# EAGLE design Passthrough Meter (EAGLE 6.2)
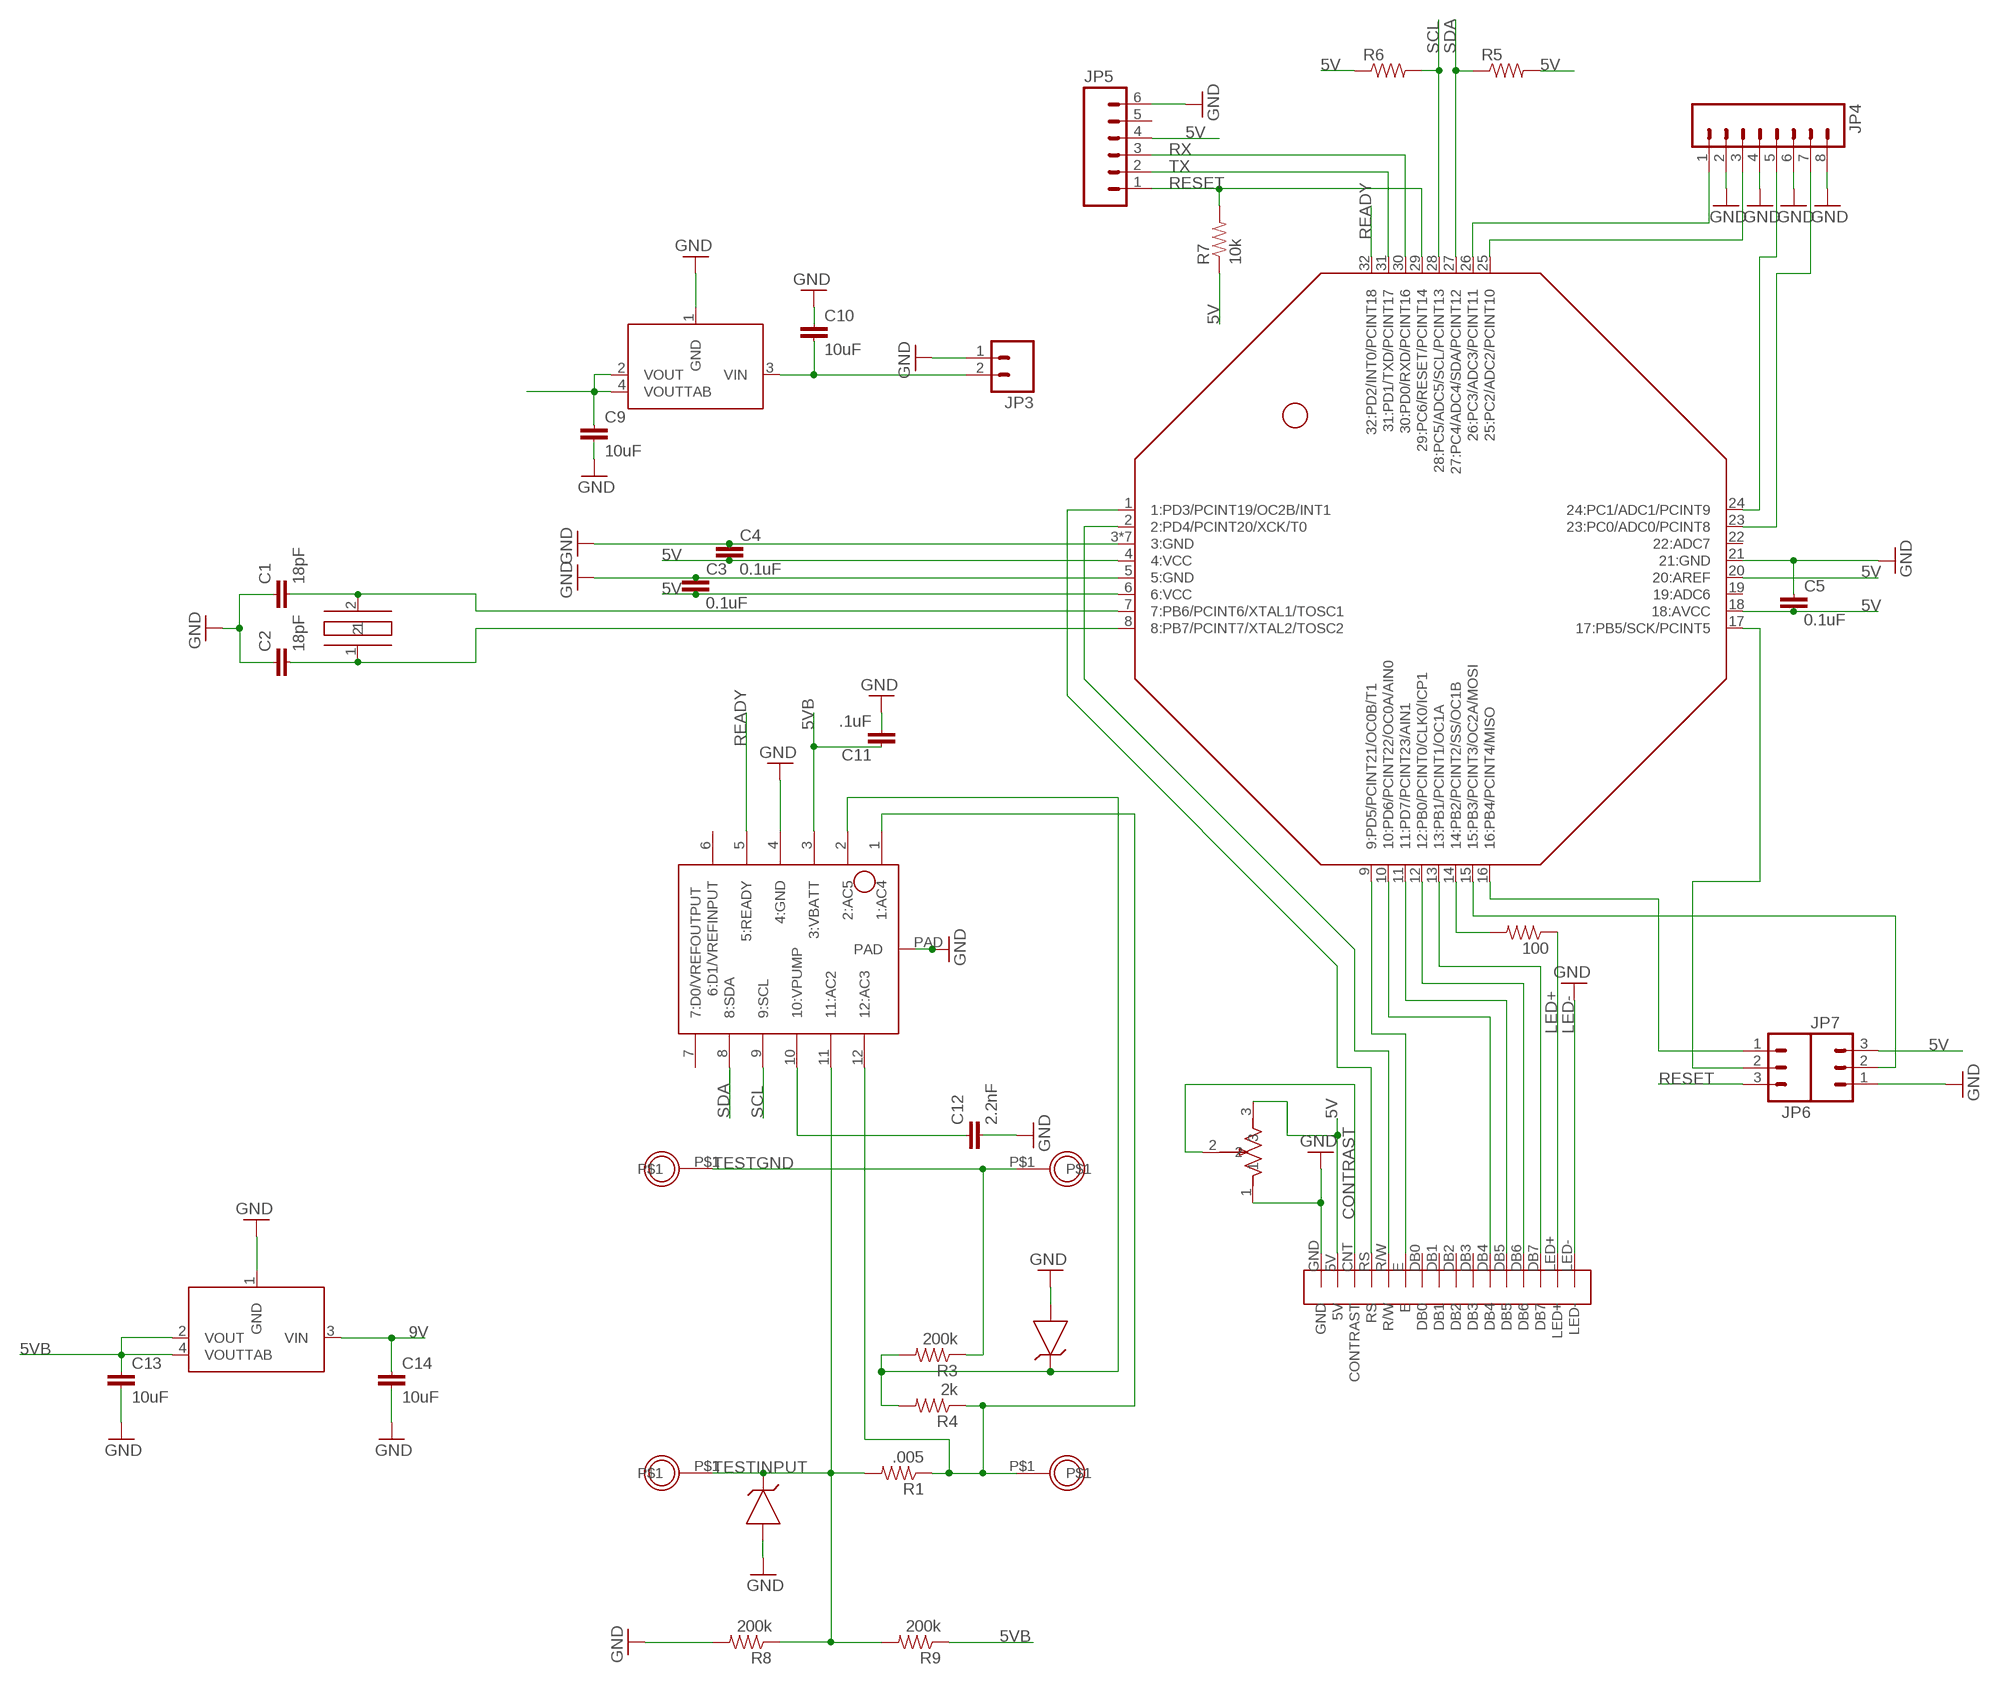
[diagram p0: schematic, sheet 1]

## Parts
100  RESISTOR  [0805]
C1  18pF  CAP0603-CAP  [0603-CAP]
C2  18pF  CAP0603-CAP  [0603-CAP]
C3  0.1uF  CAP0805  [0805]
C4  0.1uF  CAP0805  [0805]
C5  0.1uF  CAP0805  [0805]
C9  10uF  CAP1206  [1206]
C10  10uF  CAP1206  [1206]
C11  .1uF  CAP0805  [0805]
C12  2.2nF  CAP0805  [0805]
C13  10uF  CAP1206  [1206]
C14  10uF  CAP1206  [1206]
JP3  M02LOCK  [1X02_LOCK]
JP4  M08LOCK  [1X08_LOCK]
JP5  M06LOCK  [1X06_LOCK]
JP6  M03LOCK  [1X03_LOCK]
JP7  M03LOCK  [1X03_LOCK]
R1  .005  RESISTOR-OAR-5  [OAR5]
R3  200k  RESISTOR-PRECISION-R1  [PRECISION-R1]
R4  2k  RESISTOR  [0805]
R5  RESISTOR  [0805]
R6  RESISTOR  [0805]
R7  10k  RESISTOR  [0805]
R8  200k  RESISTOR-PRECISION-R1  [PRECISION-R1]
R9  200k  RESISTOR-PRECISION-R1  [PRECISION-R1]
U$1  HC49US  [HC49US]
U$3  ATMEGA328SMD-QFN  [QFN-32]
U$4  SX8723  [MPLD-W-12-4X4]
U$5  ZENER_DIODE-SOD-323  [SOD-323]
U$6  TRIMPOTTC33X-2  [TC33X-2]
U$7  THROUGH_HOLE-3MM  THROUGH_HOLE_2.2MM  [THROUGH_HOLE_2.2MM]
U$8  THROUGH_HOLE-3MM  THROUGH_HOLE_2.2MM  [THROUGH_HOLE_2.2MM]
U$9  THROUGH_HOLE-3MM  THROUGH_HOLE_2.2MM  [THROUGH_HOLE_2.2MM]
U$10  THROUGH_HOLE-3MM  THROUGH_HOLE_2.2MM  [THROUGH_HOLE_2.2MM]
U$13  5V-LDO-ZLDO1117  [ZLDO1117]
U$14  5V-LDO-ZLDO1117  [ZLDO1117]
U$15  ZENER_DIODE-SOD-323  [SOD-323]
U$16  LCD  [LCD]

## Nets
5V: C3.2 C4.2 C5.2 C9.1 JP5.4 JP7.3 R5.2 R6.1 R7.1 U$3.4(4:VCC) U$3.6(6:VCC) U$3.18(18:AVCC) U$3.20(20:AREF) U$6.3 U$13.2(VOUT) U$13.4(VOUTTAB) U$16.5V
5VB: C11.1 C13.1 R9.1 U$4.3(3:VBATT) U$14.2(VOUT) U$14.4(VOUTTAB)
9V: C10.2 C14.1 JP3.2 U$13.3(VIN) U$14.3(VIN)
A0: JP4.7 U$3.23(23:PC0/ADC0/PCINT8)
A1: JP4.5 U$3.24(24:PC1/ADC1/PCINT9)
A2: JP4.3 U$3.25(25:PC2/ADC2/PCINT10)
A3: JP4.1 U$3.26(26:PC3/ADC3/PCINT11)
CONTRAST: U$6.2 U$16.CNT(CONTRAST)
DB7: JP7.2 U$3.15(15:PB3/PCINT3/OC2A/MOSI)
GND: C1.1 C2.1 C3.1 C4.1 C5.1 C9.2 C10.1 C11.2 C12.2 C13.2 C14.2 JP3.1 JP4.2 JP4.4 JP4.6 JP4.8 JP5.6 JP7.1 R8.2 U$3.3(3:GND) U$3.5(5:GND) U$3.21(21:GND) U$3.P1(3:GND) U$3.P2(3:GND) U$3.P3(3:GND) U$3.P4(3:GND) U$3.P5(3:GND) U$3.PAD(3:GND) U$4.4(4:GND) U$4.PAD U$5.2(A) U$6.1 U$13.1(GND) U$14.1(GND) U$15.2(A) U$16.GND
LED+: 100.1 U$16.LED+
LED-: U$16.LED- ; supply symbol labelled GND
MISO: JP6.1 U$3.16(16:PB4/PCINT4/MISO)
N$1: C2.2 U$1.1 U$3.8(8:PB7/PCINT7/XTAL2/TOSC2)
N$2: C1.2 U$1.2 U$3.7(7:PB6/PCINT6/XTAL1/TOSC1)
N$3: 100.2 U$3.14(14:PB2/PCINT2/SS/OC1B)
N$5: U$3.13(13:PB1/PCINT1/OC1A) U$16.DB7
N$6: U$3.12(12:PB0/PCINT0/CLK0/ICP1) U$16.DB6
N$7: U$3.11(11:PD7/PCINT23/AIN1) U$16.DB5
N$8: U$3.10(10:PD6/PCINT22/OC0A/AIN0) U$16.DB4
N$9: U$3.9(9:PD5/PCINT21/OC0B/T1) U$16.E
N$10: U$3.2(2:PD4/PCINT20/XCK/T0) U$16.R/W
N$11: U$3.1(1:PD3/PCINT19/OC2B/INT1) U$16.RS
N$21: C12.1 U$4.10(10:VPUMP)
N$30: R3.2 R4.2 U$4.2(2:AC5) U$5.1(C)
READY: U$3.32(32:PD2/INT0/PCINT18) U$4.5(5:READY)
RESET: JP5.1 JP6.3 R7.2 U$3.29(29:PC6/RESET/PCINT14)
RX: JP5.3 U$3.30(30:PD0/RXD/PCINT16)
SCK: JP6.2 U$3.17(17:PB5/SCK/PCINT5)
SCL: R6.2 U$3.28(28:PC5/ADC5/SCL/PCINT13) U$4.9(9:SCL)
SDA: R5.1 U$3.27(27:PC4/ADC4/SDA/PCINT12) U$4.8(8:SDA)
TESTGND: R3.1 U$7.P$1 U$8.P$1
TESTINPUT: R1.2 R8.1 R9.2 U$4.11(11:AC2) U$9.P$1 U$15.1(C)
TESTOUTPUT: R1.1 R4.1 U$4.1(1:AC4) U$4.12(12:AC3) U$10.P$1
TX: JP5.2 U$3.31(31:PD1/TXD/PCINT17)
Unconnected: JP5.5 U$3.19(19:ADC6) U$3.22(22:ADC7) U$4.6(6:D1/VREFINPUT) U$4.7(7:D0/VREFOUTPUT) U$16.DB0 U$16.DB1 U$16.DB2 U$16.DB3

## Library data of the parts
100 R1 R3-R9 = 1dah:RESISTOR: Resistor Basic schematic elements and footprints for 0603, 1206, and PTH 1/10th watt (small) resistors.
C1-C5 C9-C14 = 1dah:CAP: Capacitor Standard 0402 ceramic capacitor, and 0.1" leaded capacitor.
JP3 = 1dah:M02: Header 2 Standard 2-pin 0.1" header. Use with straight break away headers (SKU : PRT-00116), right angle break away headers (PRT-00553), swiss pins (PRT-00743), machine pins (PRT-00117), and female headers (PRT-00115). Molex polarized connector foot print use with SKU : PRT-08233 with associated crimp pins and housings.
JP4 = 1dah:M08: Header 8 Standard 8-pin 0.1" header. Use with straight break away headers (SKU : PRT-00116), right angle break away headers (PRT-00553), swiss pins (PRT-00743), machine pins (PRT-00117), and female headers (PRT-00115).
JP5 = 1dah:M06: Header 6 Standard 6-pin 0.1" header. Use with straight break away headers (SKU : PRT-00116), right angle break away headers (PRT-00553), swiss pins (PRT-00743), machine pins (PRT-00117), and female headers (PRT-00115). Molex polarized connector foot print use with SKU : PRT-08094 with associated crimp pins and housings. NOTES ON THE VARIANTS LOCK and LOCK_LONGPADS... This footprint was designed to help hold the alignment of a through-hole component (i.e. 6-pin header) while soldering it into place. You may notice that each hole has been shifted either up or down by 0.005 of an inch from it's more standard position (which is a perfectly straight line). This slight alteration caused the pins (the squares in the middle) to touch the edges of the holes. Because they are alternating, it causes a "brace" to hold the component in place. 0.005 has proven to be the perfect amount of "off-center" position when using our standard breakaway headers. Although looks a little odd when you look at the bare footprint, once you have a header in there, the alteration is very hard to notice. Also, if you push a header all the way into place, it is covered up entirely on the bottom side. This idea of altering the position of holes to aid alignment will be further integrated into the Sparkfun Library for other footprints. It can help hold any component with 3 or more connection pins.
JP6 JP7 = 1dah:M03: Header 3 Standard 3-pin 0.1" header. Use with straight break away headers (SKU : PRT-00116), right angle break away headers (PRT-00553), swiss pins (PRT-00743), machine pins (PRT-00117), and female headers (PRT-00115). Molex polarized connector foot print use with SKU : PRT-08232 with associated crimp pins and housings.
U$1 = 1dah:HC49US: 16 MHz crystal
U$3 = 1dah:ATMEGA328SMD
U$4 = 1dah:SX8723
U$5 U$15 = 1dah:ZENER_DIODE
U$6 = 1dah:TRIMPOT: Bournes Trimpot
U$7-U$10 = 1dah:THROUGH_HOLE
U$13 U$14 = 1dah:5V-LDO: 5 V LDO, 12V input, 1 A
U$16 = 1dah:LCD

## Board
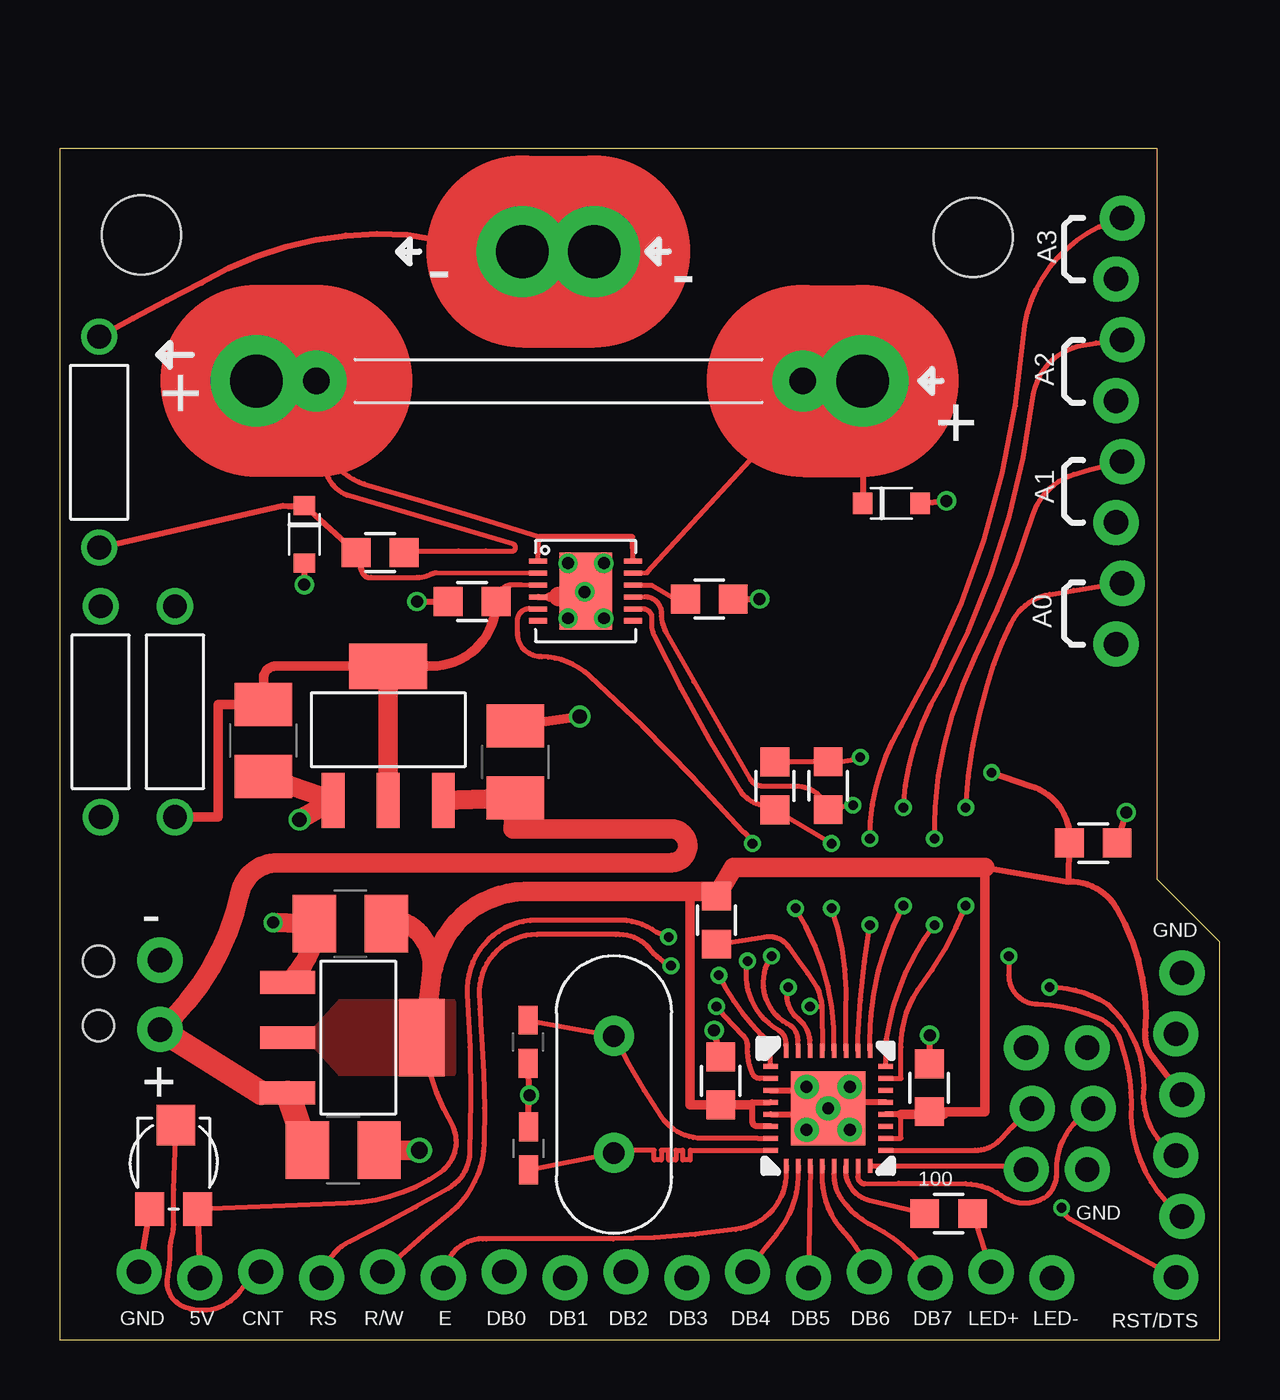
[diagram p1: board, top side]
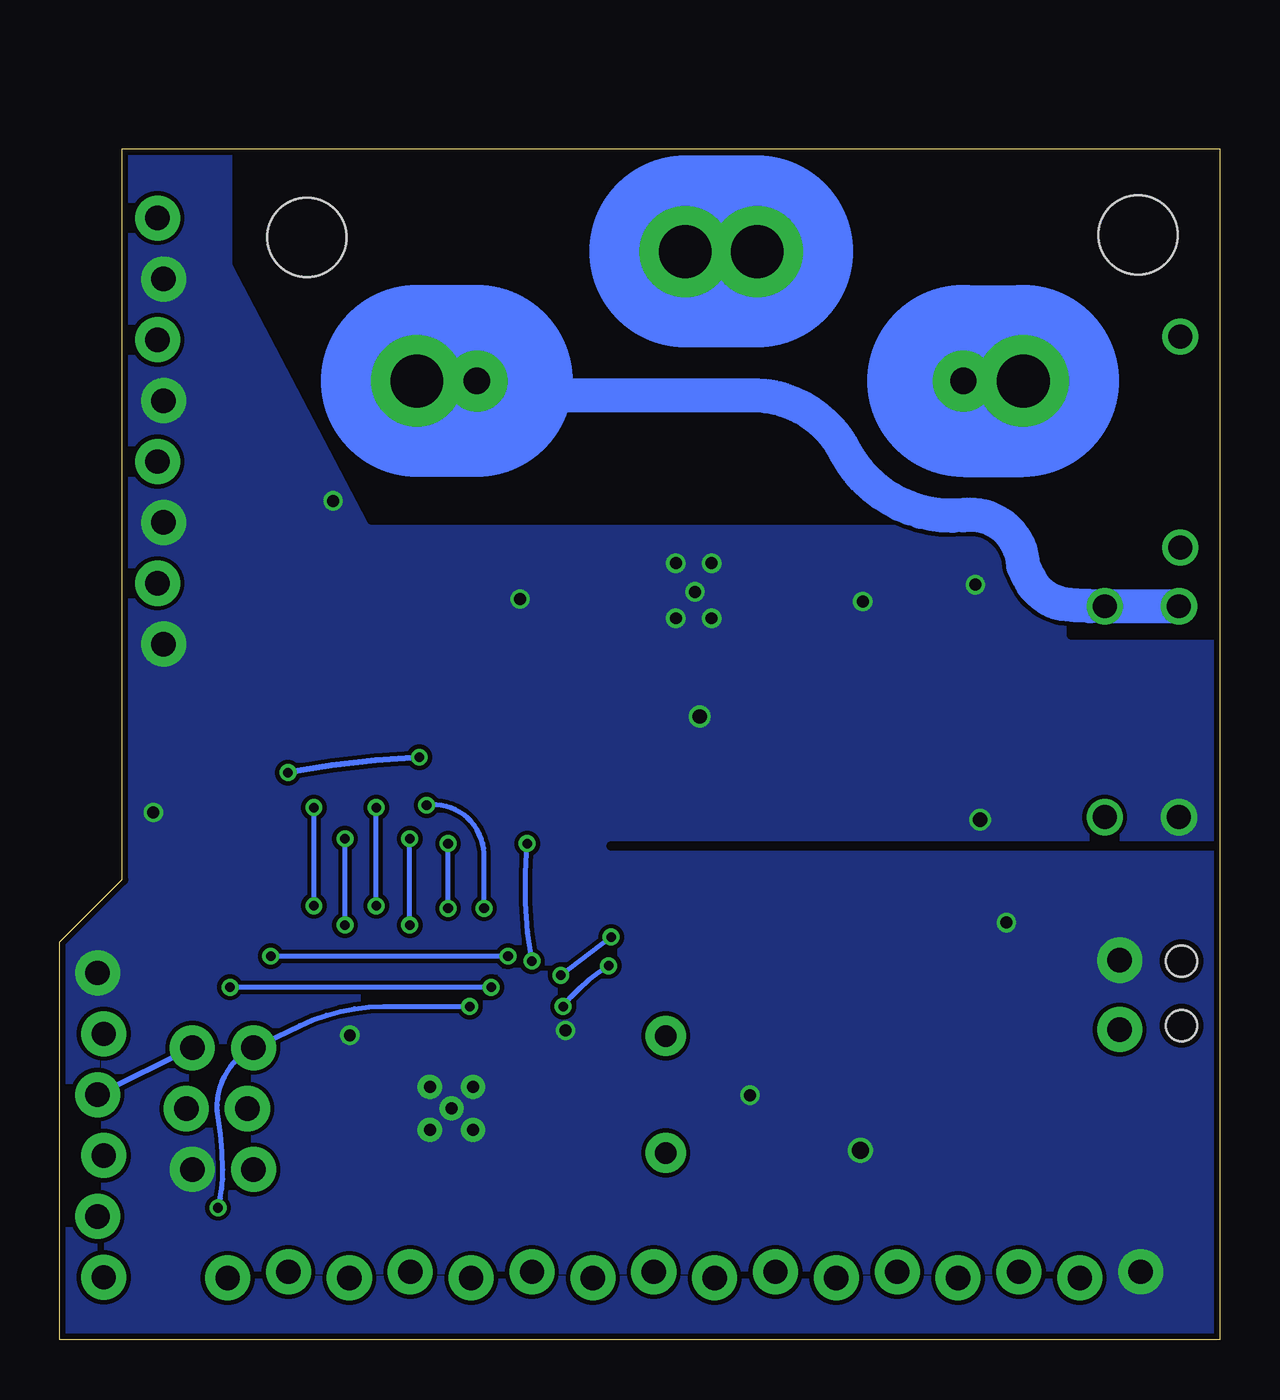
[diagram p2: board, bottom side, seen from below]

Size 48.4 x 49.7 mm. Coordinates in mm from the lower left corner, seen from the top.
Outline: 0,0 48.4,0 48.4,16.6 45.8,19.2 45.8,49.7 0,49.7 0,0
Copper layers (1*16): Top 0.035mm / dielectric 1.5mm / Bottom 0.035mm
Design rules: minimum track width 7mil, minimum drill 12mil, track to track 7mil, track to pad 7mil, pad to pad 7mil, via to via 7mil, smd to smd 0mil, copper to edge 10mil, drill to drill 10mil, minimum pad ring 10mil, minimum via ring 6mil, stop-mask expansion 2mil, vias tented up to drill 100mil, thermal gap 10mil
Holes 1.3 mm at 1.6,13.1 1.6,15.8
bRestrict: area -0.5,29.4 to 41,50.8; 1 lines

### Footprints (pad centres in the part's own frame; a part is rotated, then mirrored left to right if it is on the bottom)
0805 = smd 1.2 x 1.2: 1 -1,0; 2 1,0
0603-CAP = smd 1.2 x 0.8: 1 -0.9,0; 2 0.9,0
1206 = smd 1.8 x 2.4: 1 -1.5,0; 2 1.5,0
1X02_LOCK = drill 1.016 pad 1.88: 1 -0.178,0; 2 2.718,0
1X08_LOCK = drill 1.016 pad 1.88: 1 0,0.127; 2 2.54,-0.127; 3 5.08,0.127; 4 7.62,-0.127; 5 10.16,0.127; 6 12.7,-0.127; 7 15.24,0.127; 8 17.78,-0.127
1X06_LOCK = drill 1.016 pad 1.88: 1 0,0.127; 2 2.54,-0.127; 3 5.08,0.127; 4 7.62,-0.127; 5 10.16,0.127; 6 12.7,-0.127
1X03_LOCK = drill 1.016 pad 1.88: 1 0,0.127; 2 2.54,-0.127; 3 5.08,0.127
OAR5 = drill 1.1 pad 2.54: 1 -10.2,0; 2 10.1,0
PRECISION-R1 = drill 1: 1 4.4,0; 2 -4.4,0
HC49US = drill 0.9 pad 1.676: 1 -2.44,0; 2 2.44,0
QFN-32 = smd 0.6 x 0.2: 1 -2.4,1.75; 2 -2.4,1.25; 3 -2.4,0.75; 4 -2.4,0.25; 5 -2.4,-0.25; 6 -2.4,-0.75; 7 -2.4,-1.25; 8 -2.4,-1.75; 17 2.4,-1.75; 18 2.4,-1.25; 19 2.4,-0.75; 20 2.4,-0.25; 21 2.4,0.25; 22 2.4,0.75; 23 2.4,1.25; 24 2.4,1.75 | smd 0.2 x 0.6: 9 -1.75,-2.4; 10 -1.25,-2.4; 11 -0.75,-2.4; 12 -0.25,-2.4; 13 0.25,-2.4; 14 0.75,-2.4; 15 1.25,-2.4; 16 1.75,-2.4; 25 1.75,2.4; 26 1.25,2.4; 27 0.75,2.4; 28 0.25,2.4; 29 -0.25,2.4; 30 -0.75,2.4; 31 -1.25,2.4; 32 -1.75,2.4 | drill 0.5: P1 -0.9,0.9; P2 0.9,0.9; P3 0.9,-0.9; P4 -0.9,-0.9; P5 0,0 | smd 3.1 x 3.1: PAD 0,0
MPLD-W-12-4X4 = smd 0.22 x 0.75: 1 -1.25,-1.98; 2 -0.75,-1.98; 3 -0.25,-1.98; 4 0.25,-1.98; 5 0.75,-1.98; 6 1.25,-1.98; 7 1.25,1.98; 8 0.75,1.98; 9 0.25,1.98; 10 -0.25,1.98; 11 -0.75,1.98; 12 -1.25,1.98 | smd 3.2 x 2.2: PAD 0,0
SOD-323 = smd 0.8 x 0.9: 1 -1.2,0; 2 1.2,0
TC33X-2 = smd 1.2 x 1.4: 1 -1,-1.9; 3 1,-1.9 | smd 1.6 x 1.7: 2 0.1,1.6
THROUGH_HOLE_2.2MM = drill 2.2 pad 3.81: P$1 0,0
STAND-OFF = hole 3.302: 0,0
ZLDO1117 = smd 0.95 x 2.3: 1 -2.3,-3; 2 0,-3; 3 2.3,-3 | smd 3.25 x 1.9: 4 0,2.6
LCD = drill 1.016 pad 1.88: 5V 2.54,-0.127; CNT 5.08,0.127; DB0 15.24,0.127; DB1 17.78,-0.127; DB2 20.32,0.127; DB3 22.86,-0.127; DB4 25.4,0.127; DB5 27.94,-0.127; DB6 30.48,0.127; DB7 33.02,-0.127; E 12.7,-0.127; GND 0,0.127; LED+ 35.56,0.127; LED- 38.1,-0.127; R/W 10.16,0.127; RS 7.62,-0.127

### Placement (x,y rotation side)
100  37.09,5.26 180 top
C1  19.54,12.43 90 top
C2  19.56,7.98 270 top
C3  27.58,10.8 270 top
C4  36.28,10.51 270 top
C5  43.12,20.72 180 top
C9  12.12,17.35 180 top
C10  11.82,7.9 180 top
C11  17.2,30.8 180 top
C12  27.1,30.9 0 top
C13  8.5,25 270 top
C14  19,24.1 90 top
JP3  4.17,15.66 270 top
JP4  44.2,46.8 270 top
JP5  46.7,2.6 90 top
JP6  40.45,7.1 90 top
JP7  43,7.1 90 top
R1  20.9,40 0 top
R3  1.64,37.45 90 top
R4  13.36,32.84 180 top
R5  29.84,23.1 90 top
R6  32.06,23.11 270 top
R7  27.4,17.5 270 top
R8  1.7,26.2 90 top
R9  4.8,26.2 270 top
U$1  23.12,10.23 90 top
U$3  32.06,9.65 0 top
U$4  21.94,31.24 270 top
U$5  10.2,33.6 270 top
U$6  4.75,7.35 0 top
U$7  19.3,45.4 0 top
U$8  22.3,45.4 0 top
U$9  33.5,40 180 top
U$10  8.2,40 180 top
U$11  [STAND-OFF]  3.4,46.1 0 top
U$12  [STAND-OFF]  38.1,46 0 top
U$13  12.5,12.6 270 top
U$14  13.7,25.5 0 top
U$15  34.7,34.9 0 top
U$16  3.3,2.7 0 top

### Tracks (layer width: path | path; a pad name or v marks a point on that pad's centre or on a via)
5V  (via drill 0.4)
  Top 0.2: U$6.3 12,5.7 arc34 15.9,7 arc79 16.4,8.9 arc-20 U$13.4 | U$3.18 35.1,8.4 35.1,9.4 | R5.2 R6.1 arc24 v33.4,24.3
  Top 0.254: 14.1,17.5 C9.1 13.8,17.7 | 28.9,9.9 U$3.4 | U$3.6 29.1,8.9 arc-90 28.9,9.1 28.9,9.9 | 35.1,9.4 U$3.20 | 38.6,19.7 42.1,19.1 | 42.1,19.1 C5.2 arc80 40.5,23.1 v38.88,23.66 | JP5.4 45.6,11.8 arc-42 45.3,12.8 arc35 44.1,18 arc62 42.1,19.1 | U$6.3 U$16.5V | 28.8,9.8 28.9,9.9
  Top 0.406: 15.5,15.2 15.6,15.5 | R7.1 26.3,18.5 26.3,9.8 C3.2 28.8,9.8 | 38.6,19.7 38.6,9.51 | 35.1,9.4 36.88,9.4 C4.2 38.6,9.51 | 38.6,9.51 38.1,9.5
  Top 0.813: 14.1,17.5 arc-85 15.5,15.2 arc-8 U$13.4 | 15.6,15.5 arc-78 19.4,18.7 27.4,18.7 R7.1 28.1,19.7 38.6,19.7
  Bottom 0.254: v33.4,24.3 arc-8 v38.88,23.66 | JP7.3 JP5.4
  pour Top (no thermals): 8.5,12.9 10.6,12.9 11.7,14.1 16.4,14.1 16.4,11.1 11.7,11.1 10.6,12.3 8.5,12.3
5VB
  Top 0.2: C11.1 arc-90 18.9,31.5 arc-1 U$4.3
  Top 0.406: R9.1 6.6,21.8 6.6,26.5 C13.1 8.5,27.6 arc-100 9.1,28.1 U$14.4 15.5,28.1 arc90 C11.1
  Top 0.813: U$14.4 U$14.2
9V
  Top 0.406: 8.4,10.3 arc44 U$13.3
  Top 0.813: JP3.2 arc37 7.5,18.6 arc-78 9.1,19.9 25.5,19.9 arc188 25.4,21.3 18.9,21.3 C14.1 U$14.3
  Top 1.016: JP3.2 8.4,10.3 | U$13.3 C10.2
A0  (via drill 0.4)
  Top 0.2: U$3.23 35.1,10.9 35.1,12.2 arc-33 35.8,14.6 arc16 v37.8,18.1 | v37.8,22.2 arc-13 38.7,27.3 arc-10 39.7,29.9 arc-55 41.3,31.1 arc-2 JP4.7
  Bottom 0.2: v37.8,18.1 v37.8,22.2
A1  (via drill 0.4)
  Top 0.2: U$3.24 34.5,12.5 arc-30 v36.5,17.3 | v36.5,20.9 arc-27 38.2,28.5 arc9 40.6,34.4 arc-55 42.3,36.1 arc-5 JP4.5
  Bottom 0.2: v36.5,17.3 v36.5,20.9
A2  (via drill 0.4)
  Top 0.2: U$3.25 33.8,12.5 arc-27 v35.2,18.1 | v35.2,22.2 arc-28 36.8,27.3 arc21 40.6,39.3 arc-73 42.7,41.5 arc-4 JP4.3
  Bottom 0.2: v35.2,18.1 v35.2,22.2
A3  (via drill 0.4)
  Top 0.2: U$3.26 33.3,12.6 arc-6 v33.8,17.3 | v33.8,20.9 arc-31 35.1,25.6 arc26 40.2,41.8 arc-70 JP4.1
  Bottom 0.2: v33.8,17.3 v33.8,20.9
CONTRAST
  Top 0.2: U$6.2 4.75,6.25 4.75,4.8 arc-13 4.7,4.4 arc15 4.6,3.7 arc-13 4.5,2.6 arc76 5.1,1.4 arc79 7.5,2 arc-20 U$16.CNT
DB7
  Top 0.2: JP7.2 arc65 41.6,7 arc-48 41.2,6 arc-71 39.3,6 arc34 37.8,6.5 arc3 33.6,6.5 arc-93 33.3,6.8 U$3.15
GND  (via drill 0.5, 0.6, 0.7)
  Top 0.254: C1.1 v19.6,10.2 arc9 C2.1 | C3.1 v27.3,12.9 | C4.1 v36.3,12.7 | C5.1 v44.5,22 | U$13.1 9.6,15 | 10.7,17.7 arc-3 C9.2 | v14.9,30.8 C11.2 | U$4.4 20.43,30.99 | U$5.2 v10.2,31.5 | U$15.2 v37,35 | v21.9,31.2 arc59 U$4.PAD | C12.2 v29.2,30.9 | U$3.3 31.16,10.4 U$3.P1 | U$3.5 31.16,9.4 U$3.P4 | U$3.21 32.96,9.9 U$3.P2 | U$6.1 U$16.GND
  Top 0.406: 20.43,30.99 arc4 20.8,31 | C14.2 v21.7,26
  Top 0.813: C10.1 v15,7.9 | C9.2 v8.9,17.4 | 9.6,15 arc50 10.7,17.7 | 20.8,31 arc10 v21.9,31.2 | C13.2 U$14.1 v10,21.7
  other vias: 21.2,30.1 22.7,32.4 21.2,32.4 22.7,30.1
  pour Bottom (no thermals): -6.2,-6.8 60.5,-6.8 60.5,57.7 -6.2,57.7
LED+
  Top 0.2: 100.1 U$16.LED+
MISO
  Top 0.2: U$3.16 40.32,7.25 JP6.1
N$1
  Top 0.2: C2.2 U$1.1 23.12,7.9 24.8,7.9 24.8,7.5 25.1,7.5 25.1,7.9 25.4,7.9 25.4,7.5 25.7,7.5 25.7,7.9 26,7.9 26,7.5 26.3,7.5 26.3,7.9 U$3.8
N$2
  Top 0.2: C1.2 U$1.2 arc8 25.1,9.3 arc56 26.8,8.4 29.1,8.4 arc7 U$3.7
N$3
  Top 0.2: 100.2 33.8,5.8 arc-85 U$3.14
N$5
  Top 0.2: U$3.13 32.3,6.9 arc37 32.6,5.9 arc29 34,4.7 arc-33 U$16.DB7
N$6
  Top 0.2: U$3.12 31.8,6.9 arc44 32.7,4.5 arc-20 U$16.DB6
N$7
  Top 0.2: U$3.11 U$16.DB5
N$8
  Top 0.2: U$3.10 30.8,6.8 arc-39 29.9,4.4 arc5 U$16.DB4
N$9
  Top 0.2: U$3.9 30.3,6.8 arc-81 28.2,4.6 arc-8 23.1,4.2 17.8,4.2 arc94 U$16.E
N$10  (via drill 0.4)
  Top 0.2: U$3.2 29.2,10.9 arc-67 28.9,11.1 arc-25 28.7,12.2 arc48 28.5,12.7 arc-6 v27.4,13.9 | v25.5,15.6 arc-25 24.7,16.2 arc58 23.2,16.9 19.9,16.9 arc92 17.5,14.4 arc2 17.6,12.6 arc-5 17.7,8.2 arc-49 16.3,5.3 arc2 U$16.R/W
  Bottom 0.2: v27.4,13.9 arc22 v25.5,15.6
N$11  (via drill 0.4)
  Top 0.2: U$3.1 29.66,12.34 29.3,12.7 arc-18 v27.5,15.2 | v25.4,16.8 24.9,17 arc38 23.2,17.5 19.9,17.5 arc94 17,14.4 arc-6 17.1,7.8 arc-58 16.2,6.3 arc-4 12.1,4.1 arc52 U$16.RS
  Bottom 0.2: v27.5,15.2 v25.4,16.8
N$21
  Top 0.2: U$4.10 24.69,31.48 25.7,30.89 C12.1
N$30
  Top 0.2: 12.6,32.1 arc99 13,31.8 14.9,31.8 arc23 15.4,31.9 arc-23 15.7,32 U$4.2
  Top 0.254: 12.6,32.1 R4.2 U$5.1 arc-13 9.3,34.8 R3.2
READY  (via drill 0.4)
  Top 0.2: U$3.32 30.3,12.4 arc59 30,12.9 arc-72 v28.7,15.8 | v28.9,20.7 arc38 28.5,21.2 arc6 22.1,27.7 arc41 20.1,28.5 arc-93 19.1,29.5 19.1,30.1 arc-80 19.6,30.5 U$4.5
  Bottom 0.2: v28.7,15.8 arc16 v28.9,20.7
RESET  (via drill 0.4)
  Top 0.2: R7.2 29.4,16.8 arc-67 30.4,16.4 arc-2 31.6,14.7 arc-14 31.8,13.9 | JP5.1 42.2,5 arc-46 v41.8,5.5 | v31.3,13.9 31.8,13.9 | 31.8,13.9 U$3.29
  Bottom 0.2: v41.8,5.5 arc-17 41.6,7.1 arc-7 41.8,9.3 arc72 JP6.3 38.4,13.1 arc25 34.9,13.9 v31.3,13.9
RX  (via drill 0.4)
  Top 0.2: U$3.30 31.3,12.5 arc45 30.8,13.4 arc-69 v30.4,14.7 | v41.3,14.7 arc-35 43.7,14 arc-55 45.2,10.1 arc55 JP5.3
  Bottom 0.2: v30.4,14.7 v41.3,14.7
SCK
  Top 0.2: U$3.17 38.2,7.9 arc49 39.3,8.4 arc-9 JP6.2
SCL  (via drill 0.4)
  Top 0.2: U$3.28 32.3,13 arc29 v30.7,18 | v33.1,22.3 R6.2 arc72 30.7,23.1 29.4,23.1 arc-66 28.8,23.4 arc-1 25.3,29.5 arc-30 25.1,30.3 arc92 24.4,31 U$4.9
  Bottom 0.2: v30.7,18 30.7,20.1 arc-100 v33.1,22.3
SDA  (via drill 0.4)
  Top 0.2: U$3.27 32.8,13.7 arc23 v32.2,18 | v32.2,20.7 R5.1 arc21 29.3,22.3 arc-47 28.4,22.9 arc-7 24.8,29.4 arc-23 24.7,29.8 24.7,30.2 arc77 24.3,30.5 U$4.8
  Bottom 0.2: v32.2,18 v32.2,20.7
TESTGND
  Top 0.254: U$7.P$1 arc-3 14.5,46.1 arc35 5.9,44.1 arc2 R3.1
  Top 8: U$7.P$1 U$8.P$1
  Bottom 8: U$7.P$1 U$8.P$1
TESTINPUT
  Top 0.2: U$4.11 24.5,32 30.47,38.49
  Top 0.254: R1.2 30.47,38.49 29.8,36.6 | U$9.P$1 U$15.1
  Top 8: R1.2 U$9.P$1
  Bottom 1.422: R1.2 arc-26 28.4,39.4 19.7,39.4 arc66 15.6,37 arc-67 10.7,34.4 arc96 8.2,32.3 arc-5 7.8,31.5 arc-40 6.6,30.7 arc-8 R9.2 R8.1
  Bottom 8: R1.2 U$9.P$1
TESTOUTPUT
  Top 0.2: 14.9,32.9 arc1 15.5,32.9 arc-1 18.9,32.9 arc144 18.9,33.2 12.1,35.2 arc-82 11.1,36.7 | 20,33.5 arc1 12.7,35.7 arc-62 10.9,37.8 | U$4.1 20,33.5 | U$4.12 23.9,33.5 20,33.5
  Top 0.254: R4.1 14.9,32.9 | 11.1,36.7 arc29 R1.1 arc15 10.9,37.8
  Top 8: R1.1 U$10.P$1
  Bottom 8: R1.1 U$10.P$1
TX  (via drill 0.4)
  Top 0.2: U$3.31 30.8,12.5 arc51 30.5,13.1 arc-99 v29.7,16 | v39.6,16 39.6,15.2 arc90 40.8,14 arc-22 43.4,13.4 arc-52 44.3,12.3 arc-19 44.7,9.8 arc55 JP5.2
  Bottom 0.2: v29.7,16 v39.6,16

### Text on the board
tPlace: A3 | - | - | + | A2 | + | A1 | A0 | - | GND | + | GND | RST/DTS